# Altium schematic sheet Full-Wave Rectifier.schdoc: Full-Wave Rectifier
size Letter; Date: 2017-07-17; DocumentNumber: 6; Revision: B; SheetNumber: 6; SheetTotal: 16; DesignedBy: Mike MacKay
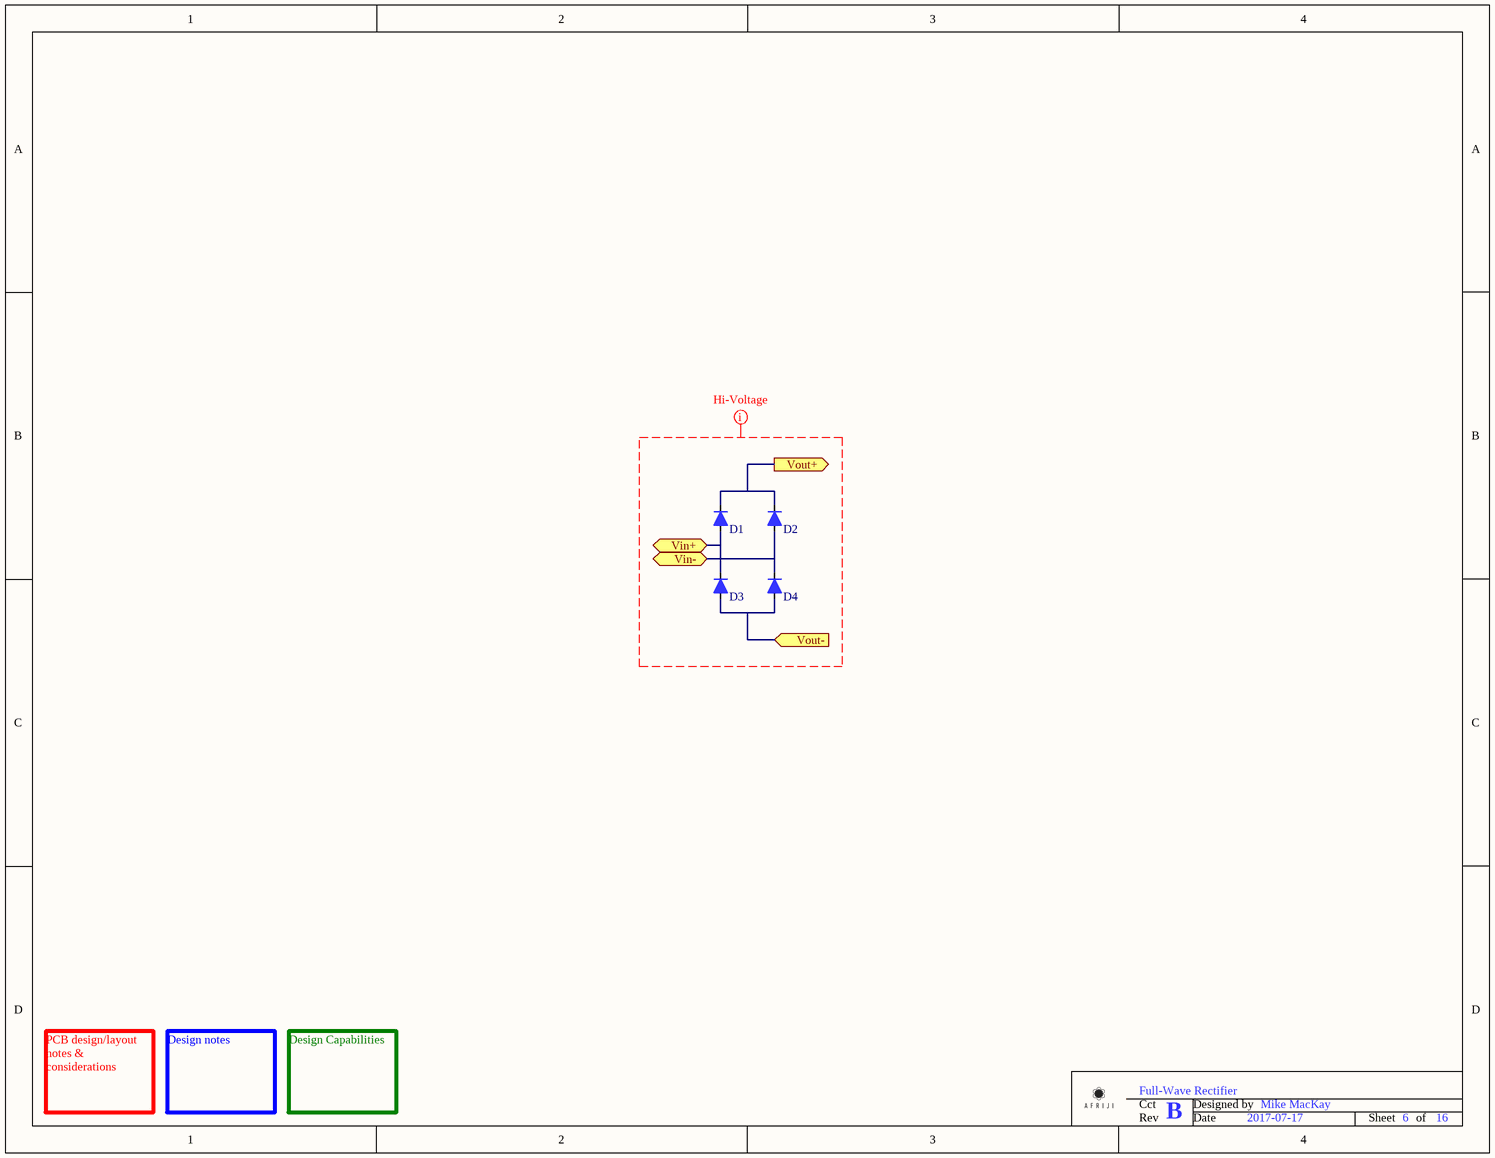
[diagram p0: Full-Wave Rectifier.schdoc]

## Parts
D1  Diode - Signal 1A  (value not drawn)
D2  Diode - Signal 1A  (value not drawn)
D3  Diode - Signal 1A  (value not drawn)
D4  Diode - Signal 1A  (value not drawn)

## Ports
Vin+ (bidir), Vin- (bidir), Vout+ (out), Vout- (in)

## Nets
Vin+: D1.1(Anode) D3.2(Cathode) ; port Vin+
Vin-: D2.1(Anode) D4.2(Cathode) ; port Vin-
Vout+: D1.2(Cathode) D2.2(Cathode) ; port Vout+
Vout-: D3.1(Anode) D4.1(Anode) ; port Vout-

## Layout directives
net class 171-250V: (no net found under the mark)

## Notes on the sheet
- PCB design/layout notes & considerations
- Design notes
- Design Capabilities
- Cct
- Designed by
- Rev
- Date
- Sheet
- of

## Library data of the parts
D1-D4 = Diode - Signal 1A: Signal Diode; Manufacturer: Vishay Semiconductor Diodes Division; Manufacturer Part Number: US1G-E3/5AT; Diode Type: Standard; Voltage - DC Reverse (Vr) (Max): 400V; Voltage - Forward (Vf) (Max) @ If: 1V @ 1A; Speed: Fast Recovery =< 500ns, > 200mA (Io); Reverse Recovery Time (trr): 50ns; Current - Reverse Leakage @ Vr: 10µA @ 400V; Capacitance @ Vr, F: 15pF @ 4V, 1MHz; Supplier 1: Digi-Key; Supplier Part Number 1: US1G-E3/5ATGICT-ND; RoHS: RoHS Compliant; Category: Discrete Semiconductor Products; Stock 1: 29002; Pricing 1: 1=0.41, 10=0.312, 25=0.2816, 100=0.1945, 250=0.1638, 500=0.1331, 1000=0.10238, 2500=0.09214 (USD); Packaging: Cut Tape (CT); Part Status: Active; Current - Average Rectified (Io): 1A; Mounting Type: Surface Mount; Package / Case: DO-214AC, SMA; Supplier Device Package: DO-214AC (SMA); Operating Temperature - Junction: -55°C ~ 150°C; ComponentLink1URL: http://www.vishay.com/docs/88768/us1.pdf; ComponentLink1Description: Spec Sheet